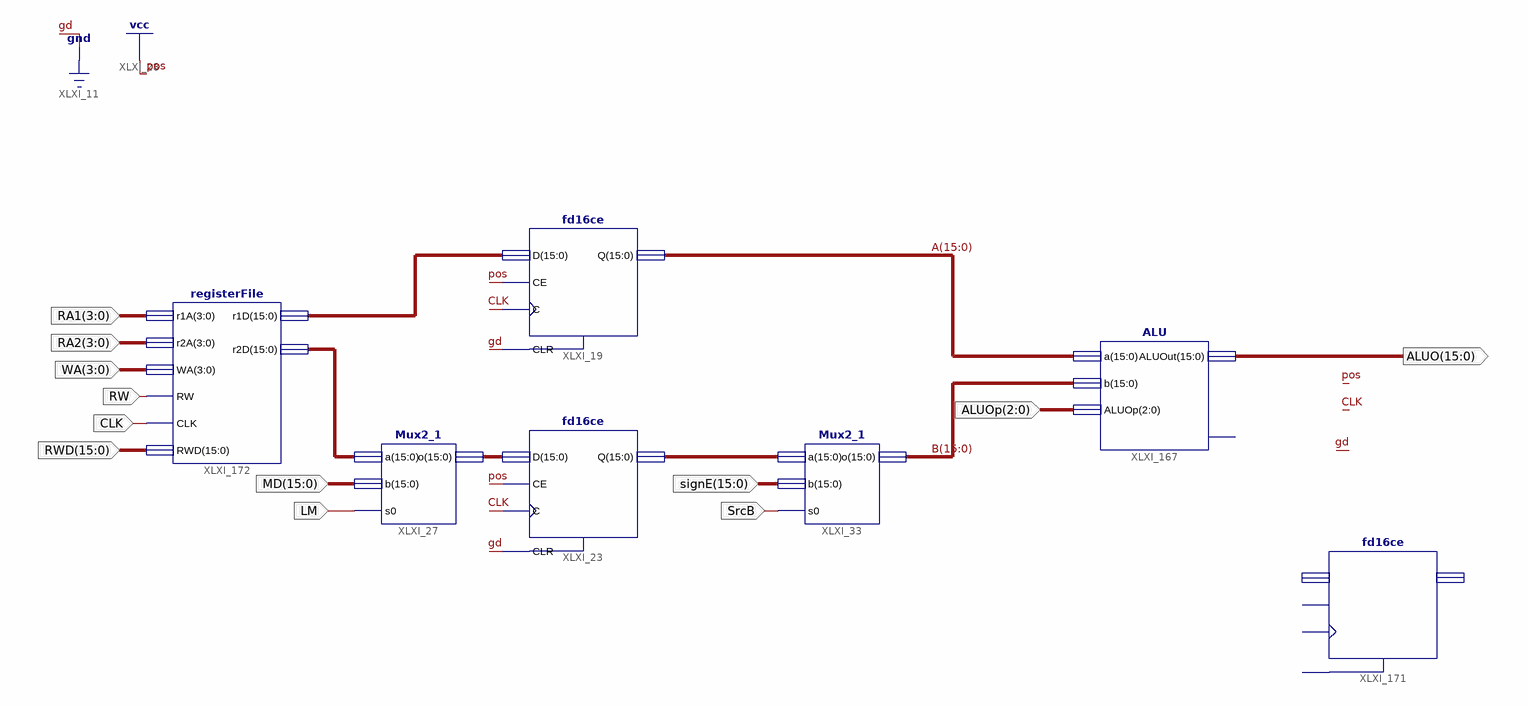
[diagram p0: schematic sheet 1]
// Xilinx ISE schematic IntegratedTestRF_ALU.sch (spartan3e) as structural Verilog: 7 symbols, 12 ports
module IntegratedTestRF_ALU (
  input  CLK,
  input  LM,
  input  [2:0] ALUOp,
  input  SrcB,
  input  RW,
  input  [3:0] RA1,
  input  [3:0] RA2,
  input  [3:0] WA,
  input  [15:0] RWD,
  input  [15:0] MD,
  input  [15:0] signE,
  output [15:0] ALUO
);

  wire [15:0] A, B, XLXN_70, XLXN_90, XLXN_94, XLXN_111;

  fd16ce XLXI_23 (.C(CLK), .CE(1'b1), .CLR(1'b0), .D(XLXN_90), .Q(XLXN_94));
  ALU XLXI_167 (.a(A), .b(B), .ALUOp(ALUOp), .ALUOut(ALUO));  // open: Overflow
  Mux2_1 XLXI_27 (.a(XLXN_111), .b(MD), .s0(LM), .o(XLXN_90));
  registerFile XLXI_172 (.RWD(RWD), .r1D(XLXN_70), .r1A(RA1), .r2A(RA2), .WA(WA), .RW(RW), .CLK(CLK), .r2D(XLXN_111));
  fd16ce XLXI_19 (.C(CLK), .CE(1'b1), .CLR(1'b0), .D(XLXN_70), .Q(A));
  Mux2_1 XLXI_33 (.a(XLXN_94), .b(signE), .s0(SrcB), .o(B));
  fd16ce XLXI_171 ();  // open: C, CE, CLR, D, Q
endmodule
